# EAGLE design 16 ch sample-and-hold card - single-sided (EAGLE 6.5.0)
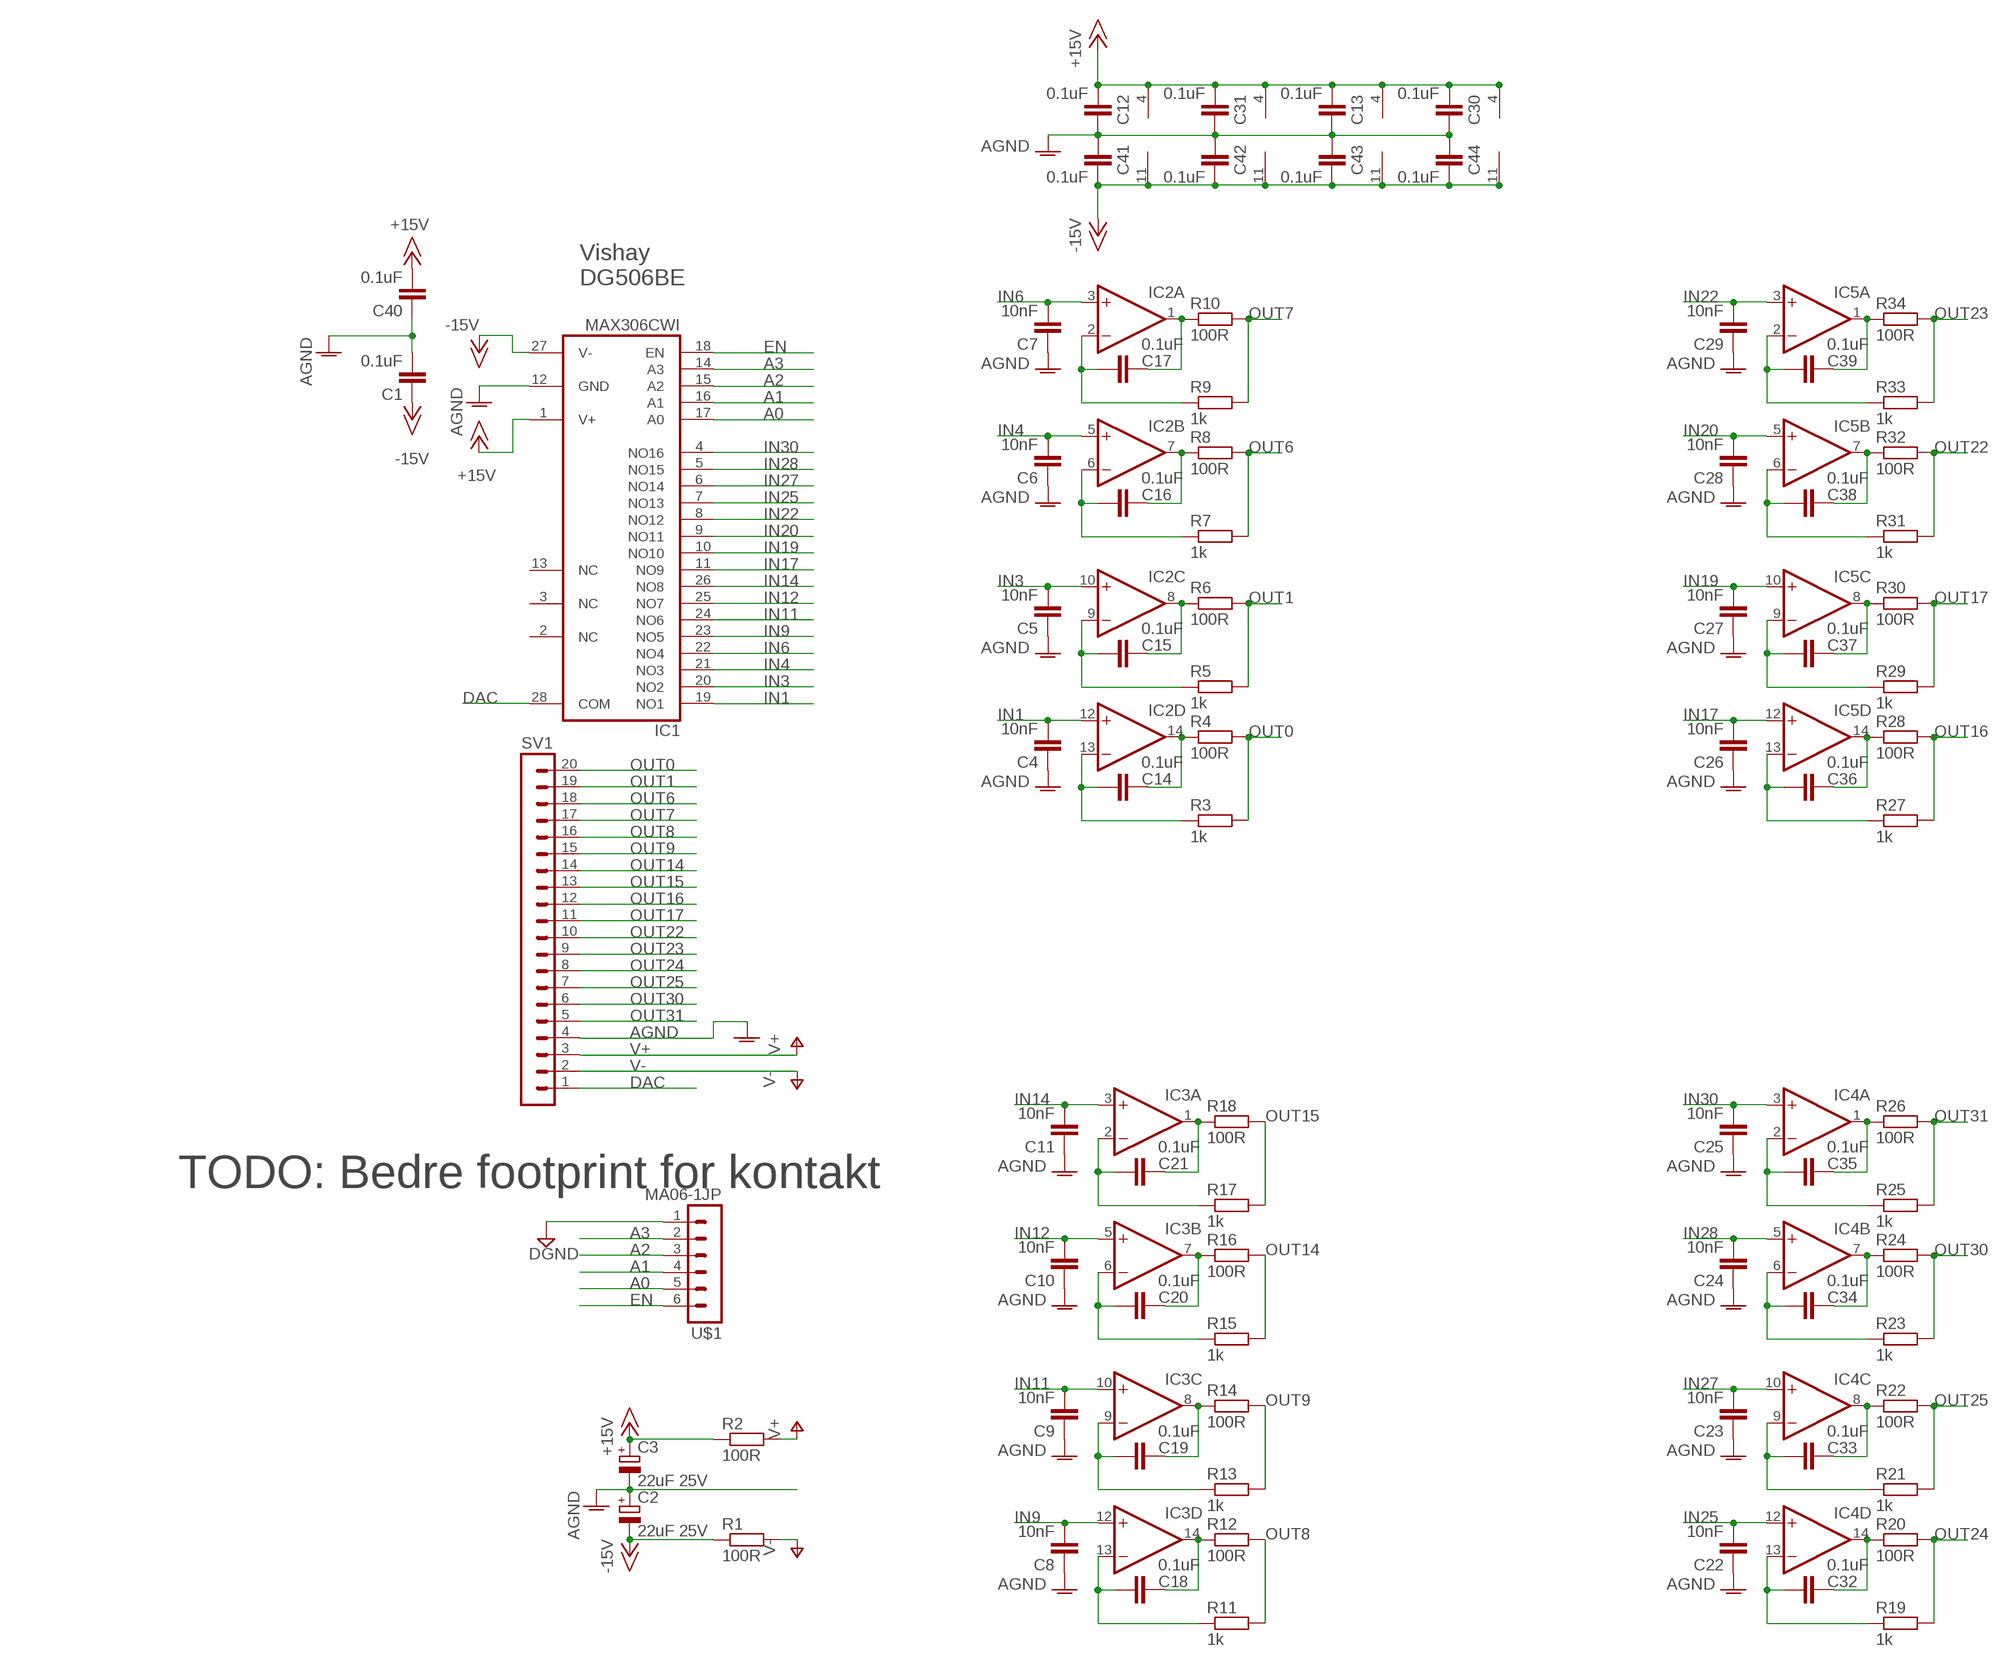
[diagram p0: schematic, sheet 1]

## Parts
C1  0.1uF  C-EUC0603  [C0603]
C2  22uF 25V  CPOL-EUE2.5-5  [E2,5-5]
C3  22uF 25V  CPOL-EUE2.5-5  [E2,5-5]
C4  10nF  C-EUC1206  [C1206]
C5  10nF  C-EUC1206  [C1206]
C6  10nF  C-EUC1206  [C1206]
C7  10nF  C-EUC1206  [C1206]
C8  10nF  C-EUC1206  [C1206]
C9  10nF  C-EUC1206  [C1206]
C10  10nF  C-EUC1206  [C1206]
C11  10nF  C-EUC1206  [C1206]
C12  0.1uF  C-EUC0603  [C0603]
C13  0.1uF  C-EUC0603  [C0603]
C14  0.1uF  C-EUC0603  [C0603]
C15  0.1uF  C-EUC0603  [C0603]
C16  0.1uF  C-EUC0603  [C0603]
C17  0.1uF  C-EUC0603  [C0603]
C18  0.1uF  C-EUC0603  [C0603]
C19  0.1uF  C-EUC0603  [C0603]
C20  0.1uF  C-EUC0603  [C0603]
C21  0.1uF  C-EUC0603  [C0603]
C22  10nF  C-EUC1206  [C1206]
C23  10nF  C-EUC1206  [C1206]
C24  10nF  C-EUC1206  [C1206]
C25  10nF  C-EUC1206  [C1206]
C26  10nF  C-EUC1206  [C1206]
C27  10nF  C-EUC1206  [C1206]
C28  10nF  C-EUC1206  [C1206]
C29  10nF  C-EUC1206  [C1206]
C30  0.1uF  C-EUC0603  [C0603]
C31  0.1uF  C-EUC0603  [C0603]
C32  0.1uF  C-EUC0603  [C0603]
C33  0.1uF  C-EUC0603  [C0603]
C34  0.1uF  C-EUC0603  [C0603]
C35  0.1uF  C-EUC0603  [C0603]
C36  0.1uF  C-EUC0603  [C0603]
C37  0.1uF  C-EUC0603  [C0603]
C38  0.1uF  C-EUC0603  [C0603]
C39  0.1uF  C-EUC0603  [C0603]
C40  0.1uF  C-EUC0603  [C0603]
C41  0.1uF  C-EUC0603  [C0603]
C42  0.1uF  C-EUC0603  [C0603]
C43  0.1uF  C-EUC0603  [C0603]
C44  0.1uF  C-EUC0603  [C0603]
IC1  MAX306CWI  [SO28L]
IC2  TL074D  [SO14]
IC3  TL074D  [SO14]
IC4  TL074D  [SO14]
IC5  TL074D  [SO14]
R1  100R  R-EU_0207/7  [0207/7]
R2  100R  R-EU_0207/7  [0207/7]
R3  1k  R-EU_R0603  [R0603]
R4  100R  R-EU_R0603  [R0603]
R5  1k  R-EU_R0603  [R0603]
R6  100R  R-EU_R0603  [R0603]
R7  1k  R-EU_R0603  [R0603]
R8  100R  R-EU_R0603  [R0603]
R9  1k  R-EU_R0603  [R0603]
R10  100R  R-EU_R0603  [R0603]
R11  1k  R-EU_R0603  [R0603]
R12  100R  R-EU_R0603  [R0603]
R13  1k  R-EU_R0603  [R0603]
R14  100R  R-EU_R0603  [R0603]
R15  1k  R-EU_R0603  [R0603]
R16  100R  R-EU_R0603  [R0603]
R17  1k  R-EU_R0603  [R0603]
R18  100R  R-EU_R0603  [R0603]
R19  1k  R-EU_R0603  [R0603]
R20  100R  R-EU_R0603  [R0603]
R21  1k  R-EU_R0603  [R0603]
R22  100R  R-EU_R0603  [R0603]
R23  1k  R-EU_R0603  [R0603]
R24  100R  R-EU_R0603  [R0603]
R25  1k  R-EU_R0603  [R0603]
R26  100R  R-EU_R0603  [R0603]
R27  1k  R-EU_R0603  [R0603]
R28  100R  R-EU_R0603  [R0603]
R29  1k  R-EU_R0603  [R0603]
R30  100R  R-EU_R0603  [R0603]
R31  1k  R-EU_R0603  [R0603]
R32  100R  R-EU_R0603  [R0603]
R33  1k  R-EU_R0603  [R0603]
R34  100R  R-EU_R0603  [R0603]
SV1  MA20-1JP  [SIP-PIN20-1J]
U$1  MA06-1JP  [SIP-PIN06-1J]

## Nets
+15V: C3.+ C12.1 C13.1 C30.1 C31.1 C40.2 IC1.1(V+) IC2.4(P:V+) IC3.4(P:V+) IC4.4(P:V+) IC5.4(P:V+) R2.1
-15V: C1.1 C2.- C41.2 C42.2 C43.2 C44.2 IC1.27(V-) IC2.11(P:V-) IC3.11(P:V-) IC4.11(P:V-) IC5.11(P:V-) R1.1
A0: IC1.17(A0) U$1.5
A1: IC1.16(A1) U$1.4
A2: IC1.15(A2) U$1.3
A3: IC1.14(A3) U$1.2
AGND: C1.2 C2.+ C3.- C4.1 C5.1 C6.1 C7.1 C8.1 C9.1 C10.1 C11.1 C12.2 C13.2 C22.1 C23.1 C24.1 C25.1 C26.1 C27.1 C28.1 C29.1 C30.2 C31.2 C40.1 C41.1 C42.1 C43.1 C44.1 IC1.12(GND) SV1.4
DAC: IC1.28(COM) SV1.1
DGND: U$1.1
EN: IC1.18(EN) U$1.6
IN1: C4.2 IC1.19(NO1) IC2.12(D:+IN)
IN3: C5.2 IC1.20(NO2) IC2.10(C:+IN)
IN4: C6.2 IC1.21(NO3) IC2.5(B:+IN)
IN6: C7.2 IC1.22(NO4) IC2.3(A:+IN)
IN9: C8.2 IC1.23(NO5) IC3.12(D:+IN)
IN11: C9.2 IC1.24(NO6) IC3.10(C:+IN)
IN12: C10.2 IC1.25(NO7) IC3.5(B:+IN)
IN14: C11.2 IC1.26(NO8) IC3.3(A:+IN)
IN17: C26.2 IC1.11(NO9) IC5.12(D:+IN)
IN19: C27.2 IC1.10(NO10) IC5.10(C:+IN)
IN20: C28.2 IC1.9(NO11) IC5.5(B:+IN)
IN22: C29.2 IC1.8(NO12) IC5.3(A:+IN)
IN25: C22.2 IC1.7(NO13) IC4.12(D:+IN)
IN27: C23.2 IC1.6(NO14) IC4.10(C:+IN)
IN28: C24.2 IC1.5(NO15) IC4.5(B:+IN)
IN30: C25.2 IC1.4(NO16) IC4.3(A:+IN)
N$1: C17.2 IC2.2(A:-IN) R9.1
N$2: C17.1 IC2.1(A:OUT) R10.1
N$3: C16.1 IC2.7(B:OUT) R8.1
N$4: C15.1 IC2.8(C:OUT) R6.1
N$5: C16.2 IC2.6(B:-IN) R7.1
N$6: C14.1 IC2.14(D:OUT) R4.1
N$7: C15.2 IC2.9(C:-IN) R5.1
N$8: C14.2 IC2.13(D:-IN) R3.1
N$9: C21.1 IC3.1(A:OUT) R18.1
N$10: C21.2 IC3.2(A:-IN) R17.1
N$19: C20.1 IC3.7(B:OUT) R16.1
N$20: C20.2 IC3.6(B:-IN) R15.1
N$21: C19.1 IC3.8(C:OUT) R14.1
N$22: C18.1 IC3.14(D:OUT) R12.1
N$23: C19.2 IC3.9(C:-IN) R13.1
N$24: C18.2 IC3.13(D:-IN) R11.1
N$33: C39.1 IC5.1(A:OUT) R34.1
N$34: C39.2 IC5.2(A:-IN) R33.1
N$35: C38.1 IC5.7(B:OUT) R32.1
N$36: C38.2 IC5.6(B:-IN) R31.1
N$37: C37.1 IC5.8(C:OUT) R30.1
N$38: C36.1 IC5.14(D:OUT) R28.1
N$39: C37.2 IC5.9(C:-IN) R29.1
N$40: C36.2 IC5.13(D:-IN) R27.1
N$49: C35.1 IC4.1(A:OUT) R26.1
N$50: C35.2 IC4.2(A:-IN) R25.1
N$51: C34.1 IC4.7(B:OUT) R24.1
N$52: C34.2 IC4.6(B:-IN) R23.1
N$53: C33.1 IC4.8(C:OUT) R22.1
N$54: C32.1 IC4.14(D:OUT) R20.1
N$55: C33.2 IC4.9(C:-IN) R21.1
N$56: C32.2 IC4.13(D:-IN) R19.1
OUT0: R3.2 R4.2 SV1.20
OUT1: R5.2 R6.2 SV1.19
OUT6: R7.2 R8.2 SV1.18
OUT7: R9.2 R10.2 SV1.17
OUT8: R11.2 R12.2 SV1.16
OUT9: R13.2 R14.2 SV1.15
OUT14: R15.2 R16.2 SV1.14
OUT15: R17.2 R18.2 SV1.13
OUT16: R27.2 R28.2 SV1.12
OUT17: R29.2 R30.2 SV1.11
OUT22: R31.2 R32.2 SV1.10
OUT23: R33.2 R34.2 SV1.9
OUT24: R19.2 R20.2 SV1.8
OUT25: R21.2 R22.2 SV1.7
OUT30: R23.2 R24.2 SV1.6
OUT31: R25.2 R26.2 SV1.5
V+: R2.2 SV1.3
V-: R1.2 SV1.2
Unconnected: IC1.2(NC) IC1.3(NC) IC1.13(NC)

## Notes on the sheet
- Vishay
  DG506BE
- TODO: Bedre footprint for kontakt

## Library data of the parts
C1 C4-C44 = resistor:C-EU: CAPACITOR, European symbol
C2 C3 = resistor:CPOL-EU: POLARIZED CAPACITOR, European symbol
IC1 = maxim:MAX306CWI: MULTIPLEXER; MF: MAXIM; MPN: MAX306CWI; OC_FARNELL: unknown; OC_NEWARK: 90C2555
IC2-IC5 = linear:TL074: OP AMP
R1-R34 = resistor:R-EU_: RESISTOR, European symbol
SV1 = joakim:MA20-1J: PIN HEADER
U$1 = joakim:MA06-1J

## Board
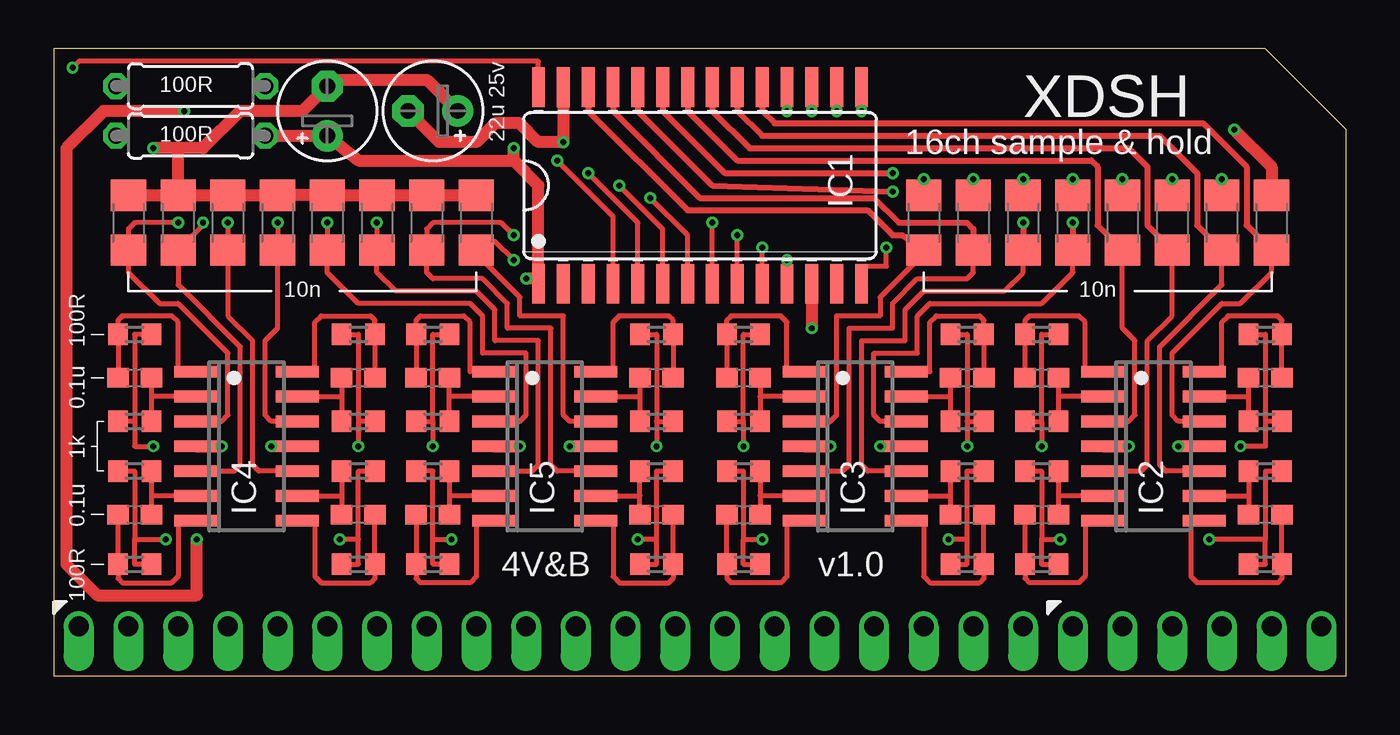
[diagram p1: board, top side]
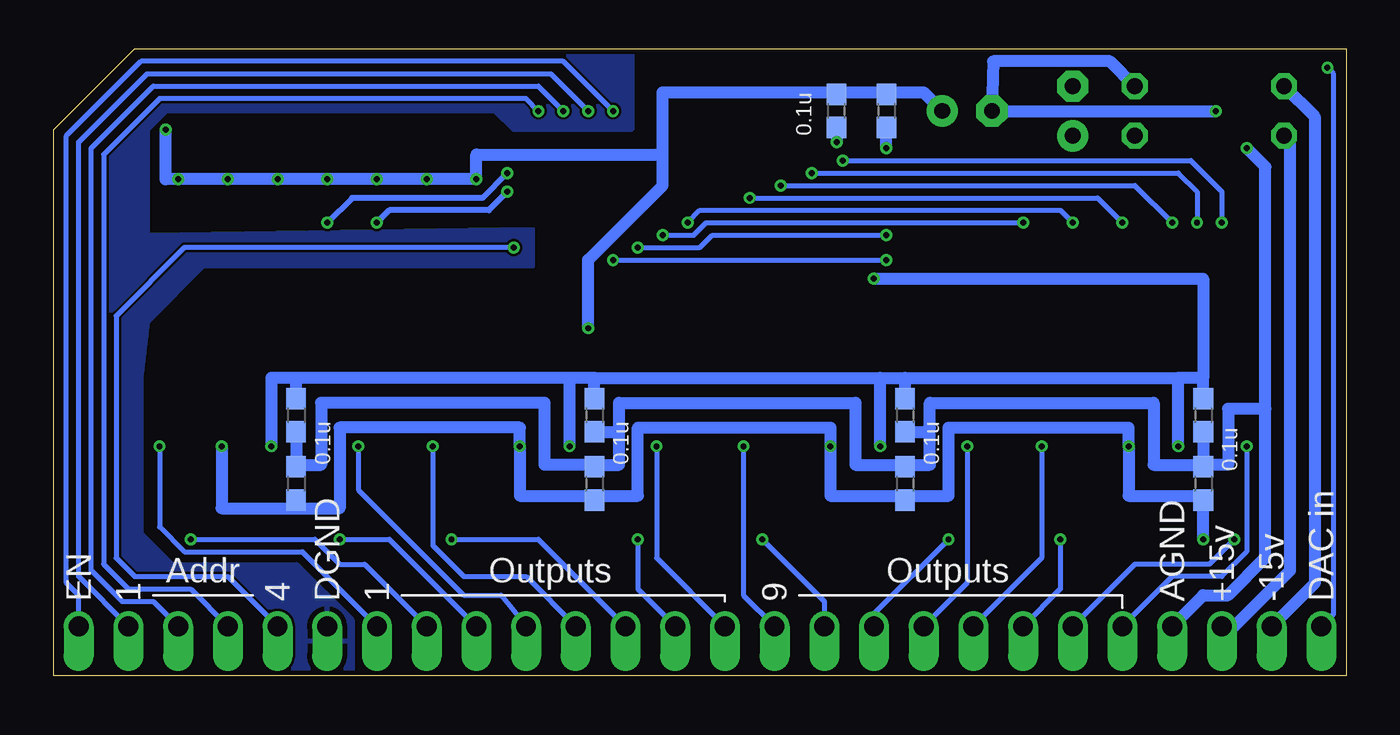
[diagram p2: board, bottom side, seen from below]

Size 66.04 x 32.07 mm. Coordinates in mm from the lower left corner, seen from the top.
Outline: 0,0 66.04,0 66.04,27.94 61.91,32.07 0,32.07 0,0
Copper layers (1*16): Top 0.035mm / dielectric 1.5mm / Bottom 0.035mm
Design rules "dirt_cheap_dirty_boards.v1": minimum track width 5mil, minimum drill 12mil, track to track 5mil, track to pad 5mil, pad to pad 5mil, via to via 5mil, smd to smd 0mil, copper to edge 10mil, drill to drill 10mil, minimum pad ring 10mil, minimum via ring 6mil, stop-mask expansion 2mil, vias tented up to drill 25mil, thermal gap 10mil

### Footprints (pad centres in the part's own frame; a part is rotated, then mirrored left to right if it is on the bottom)
C0603 = smd 1.1 x 1: 1 -0.85,0; 2 0.85,0
E2,5-5 = drill 0.813 pad 1.6: + -1.27,0 | drill 0.813 pad 1.6 octagon: - 1.27,0
C1206 = smd 1.6 x 1.8: 1 -1.4,0; 2 1.4,0
SO28L = smd 0.66 x 2.032: 1 -8.255,-5.029; 2 -6.985,-5.029; 3 -5.715,-5.029; 4 -4.445,-5.029; 5 -3.175,-5.029; 6 -1.905,-5.029; 7 -0.635,-5.029; 8 0.635,-5.029; 9 1.905,-5.029; 10 3.175,-5.029; 11 4.445,-5.029; 12 5.715,-5.029; 13 6.985,-5.029; 14 8.255,-5.029; 15 8.255,5.029; 16 6.985,5.029; 17 5.715,5.029; 18 4.445,5.029; 19 3.175,5.029; 20 1.905,5.029; 21 0.635,5.029; 22 -0.635,5.029; 23 -1.905,5.029; 24 -3.175,5.029; 25 -4.445,5.029; 26 -5.715,5.029; 27 -6.985,5.029; 28 -8.255,5.029
SO14 = smd 0.6 x 2.2: 1 -3.81,-2.6; 2 -2.54,-2.6; 3 -1.27,-2.6; 4 0,-2.6; 5 1.27,-2.6; 6 2.54,-2.6; 7 3.81,-2.6; 8 3.81,2.6; 9 2.54,2.6; 10 1.27,2.6; 11 0,2.6; 12 -1.27,2.6; 13 -2.54,2.6; 14 -3.81,2.6
0207/7 = drill 0.813 octagon: 1 -3.81,0; 2 3.81,0
R0603 = smd 1 x 1.1: 1 -0.85,0; 2 0.85,0
SIP-PIN20-1J = drill 1.016 offset: 1 -24.13,0; 2 -21.59,0; 3 -19.05,0; 4 -16.51,0; 5 -13.97,0; 6 -11.43,0; 7 -8.89,0; 8 -6.35,0; 9 -3.81,0; 10 -1.27,0; 11 1.27,0; 12 3.81,0; 13 6.35,0; 14 8.89,0; 15 11.43,0; 16 13.97,0; 17 16.51,0; 18 19.05,0; 19 21.59,0; 20 24.13,0
SIP-PIN06-1J = drill 1.016 offset: 1 -6.35,0; 2 -3.81,0; 3 -1.27,0; 4 1.27,0; 5 3.81,0; 6 6.35,0

### Placement (x,y rotation side)
C1  26.04,28.89 90 bottom
C2  19.37,28.89 180 top
C3  13.97,28.89 90 top
C4  62.23,23.18 270 top
C5  59.69,23.18 270 top
C6  57.15,23.18 270 top
C7  54.61,23.18 270 top
C8  52.07,23.18 270 top
C9  49.53,23.18 270 top
C10  46.99,23.18 270 top
C11  44.45,23.18 270 top
C12  53.66,13.34 270 bottom
C13  38.42,13.34 270 bottom
C14  61.91,15.24 180 top
C15  61.91,8.26 180 top
C16  50.48,8.26 0 top
C17  50.48,15.24 0 top
C18  46.67,15.24 180 top
C19  46.67,8.26 180 top
C20  35.24,8.26 0 top
C21  35.24,15.24 0 top
C22  11.43,23.18 270 top
C23  8.89,23.18 270 top
C24  6.35,23.18 270 top
C25  3.81,23.18 270 top
C26  21.59,23.18 270 top
C27  19.05,23.18 270 top
C28  16.51,23.18 270 top
C29  13.97,23.18 270 top
C30  7.3,13.34 270 bottom
C31  22.54,13.34 270 bottom
C32  15.56,15.24 180 top
C33  15.56,8.26 180 top
C34  4.13,8.26 0 top
C35  4.13,15.24 0 top
C36  30.8,15.24 180 top
C37  30.8,8.26 180 top
C38  19.37,8.26 0 top
C39  19.37,15.24 0 top
C40  23.5,28.89 270 bottom
C41  7.3,9.84 270 bottom
C42  22.54,9.84 270 bottom
C43  38.42,9.84 270 bottom
C44  53.66,9.84 270 bottom
IC1  33.02,25.08 0 top
IC2  56.2,11.75 270 top
IC3  40.96,11.75 270 top
IC4  9.84,11.75 270 top
IC5  25.08,11.75 270 top
R1  6.99,30.16 180 top
R2  6.99,27.62 180 top
R3  61.91,13.02 0 top
R4  61.91,17.46 180 top
R5  61.91,10.48 0 top
R6  61.91,5.71 180 top
R7  50.48,10.48 180 top
R8  50.48,5.71 0 top
R9  50.48,13.02 180 top
R10  50.48,17.46 0 top
R11  46.67,13.02 0 top
R12  46.67,17.46 180 top
R13  46.67,10.48 0 top
R14  46.67,5.71 180 top
R15  35.24,10.48 180 top
R16  35.24,5.71 0 top
R17  35.24,13.02 180 top
R18  35.24,17.46 0 top
R19  15.56,13.02 0 top
R20  15.56,17.46 180 top
R21  15.56,10.48 0 top
R22  15.56,5.71 180 top
R23  4.13,10.48 180 top
R24  4.13,5.71 0 top
R25  4.13,13.02 180 top
R26  4.13,17.46 0 top
R27  30.8,13.02 0 top
R28  30.8,17.46 180 top
R29  30.8,10.48 0 top
R30  30.8,5.71 180 top
R31  19.37,10.48 180 top
R32  19.37,5.71 0 top
R33  19.37,13.02 180 top
R34  19.37,17.46 0 top
SV1  25.4,2.54 0 top
U$1  58.42,2.54 0 top

### Tracks (layer width: path | path; a pad name or v marks a point on that pad's centre or on a via)
+15V  (via drill 0.3)
  Top 0.61: IC2.4 v54.93,11.75 | IC5.4 v23.81,11.75 | IC4.4 v8.57,11.75 | IC3.4 v39.69,11.75 | 23.5,26.35 15.56,26.35 C3.+ R2.1 | 23.5,26.35 24.77,25.08 IC1.1 24.77,20.32 v24.13,20.32 | 23.5,26.35 v23.5,26.99
  Bottom 0.61: v23.81,11.75 23.81,15.24 | v8.57,11.75 8.57,15.24 | 39.69,15.24 53.66,15.24 | 53.66,15.24 54.93,15.24 v54.93,11.75 | 38.42,15.24 23.81,15.24 | C12.1 53.66,15.24 | C13.1 38.42,15.24 | v39.69,11.75 39.69,15.24 | 38.42,15.24 39.69,15.24 | 23.81,15.24 22.54,15.24 | 22.54,15.24 8.57,15.24 | C30.1 7.3,15.24 | 7.3,15.24 8.57,15.24 | v24.13,20.32 7.3,20.32 7.3,15.24 | v23.5,26.99 C40.2 | C31.1 22.54,15.24
-15V  (via drill 0.3)
  Top 0.61: IC2.11 v57.47,11.75 | IC3.11 v42.23,11.75 | IC5.11 v26.35,11.75 | IC4.11 v11.11,11.75 | v7.3,6.99 7.3,4.13 2.22,4.13 0.64,5.71 0.64,26.99 2.54,28.89 v6.67,28.89 | C2.- 19.68,27.3 21.59,27.3 22.54,28.26 23.81,28.26 24.77,27.3 v26.04,27.3 IC1.27
  Bottom 0.254: C43.2 38.52,8.99 38.73,9.21 | C42.2 22.54,9.21
  Bottom 0.61: 53.76,8.57 51.44,8.57 51.44,12.7 42.23,12.7 v42.23,11.75 42.23,9.21 38.73,9.21 36.2,9.21 36.2,12.7 26.35,12.7 v26.35,11.75 26.35,9.21 22.54,9.21 20.32,9.21 20.32,12.7 11.11,12.7 v11.11,11.75 11.11,9.21 7.52,9.21 C41.2 v7.3,6.99 | v57.47,11.75 57.47,8.57 53.76,8.57 | 53.76,8.57 C44.2 | R1.1 12.06,31.43 18.03,31.43 C2.- v6.67,28.89 | C1.1 v26.04,27.3
A0  (via drill 0.3)
  Top 0.254: v38.73,28.89 IC1.17
  Bottom 0.254: v38.73,28.89 40.64,30.8 61.28,30.8 64.77,27.3 64.77,5.08 U$1.5
A1  (via drill 0.3)
  Top 0.254: IC1.16 v40.01,28.89 40.06,30.16 IC1.16
  Bottom 0.254: v40.01,28.89 41.27,30.16 60.96,30.16 64.14,26.99 64.14,5.4 62.55,3.81 60.96,3.81 U$1.4
A2  (via drill 0.3)
  Top 0.254: IC1.15 v41.27,28.89
  Bottom 0.254: v41.27,28.89 41.91,29.53 60.64,29.53 63.5,26.67 63.5,5.71 62.23,4.45 59.05,4.45 U$1.3
A3  (via drill 0.3)
  Top 0.254: IC1.14 41.33,20.05 41.27,20.95 42.55,20.95 v42.55,21.91
  Bottom 0.254: v42.55,21.91 59.37,21.91 62.87,18.41 62.87,6.03 61.91,5.08 57.15,5.08 U$1.2
AGND  (via drill 0.3)
  Top 0.61: C25.1 C24.1 | C24.1 C23.1 C22.1 C29.1 C28.1 C27.1 C26.1 | C11.1 v44.45,25.4 | v60.33,27.94 62.23,26.04 C4.1 62.23,24.45 | C10.1 v46.99,25.4 | C9.1 v49.53,25.4 | C8.1 v52.07,25.4 | C7.1 v54.61,25.4 | C6.1 v57.15,25.4 | C5.1 v59.69,25.4 | C2.+ 19.05,30.48 14.29,30.48 C3.- 12.7,28.89 9.53,28.89 7.62,26.99 6.35,26.99 | IC1.12 v38.73,17.78 | 6.35,26.99 v5.08,26.99 | C24.1 6.35,26.99
  Bottom 0.61: C44.1 53.66,10.79 | 53.66,10.79 52.39,10.79 52.39,13.97 40.96,13.97 40.96,10.79 38.42,10.79 | v60.33,27.94 60.33,25.4 v59.69,25.4 v57.15,25.4 v54.61,25.4 v52.07,25.4 v49.53,25.4 v46.99,25.4 v44.45,25.4 44.45,26.67 34.92,26.67 | 25.72,29.84 34.92,29.84 34.92,26.67 | 25.72,29.84 23.5,29.84 | 23.5,29.84 21.59,29.84 C2.+ | SV1.4 7.3,4.13 6.03,4.13 4.13,6.03 4.13,13.65 | 4.13,13.65 4.13,26.04 v5.08,26.99 | C43.1 38.42,10.79 | 38.42,10.79 37.15,10.79 37.15,12.38 | 37.15,12.38 37.15,13.97 25.08,13.97 25.08,10.79 22.54,10.79 | C13.2 37.25,12.48 37.15,12.38 | C12.2 53.66,10.79 | 22.54,10.79 21.27,10.79 21.27,12.7 | 21.27,12.7 21.27,13.97 9.84,13.97 9.84,10.79 7.41,10.79 C41.1 | C31.2 21.49,12.48 21.27,12.7 | C42.1 22.54,10.79 | C30.2 C41.1 | 4.13,13.65 6.03,13.65 6.03,10.79 7.2,10.79 C41.1 | v38.73,17.78 38.73,21.27 34.92,25.08 34.92,26.67 | C1.2 25.82,29.74 25.72,29.84 | C40.1 23.5,29.84
DAC  (via drill 0.3)
  Top 0.254: IC1.28 24.77,31.43 1.27,31.43 v0.95,31.11
  Bottom 0.254: SV1.1 0.64,3.17 0.64,30.8 v0.95,31.11
DGND
  pour Bottom: 36.51,32.7 36.51,27.94 42.55,27.94 43.5,28.89 60.33,28.89 61.28,27.94 61.28,22.54 41.59,22.86 41.59,20.95 58.42,20.95 61.28,18.1 61.59,15.24 61.59,7.3 60.01,5.71 53.66,5.71 50.8,2.86 50.8,-0.64 66.36,-0.64 66.67,-0.32 66.67,32.7
EN  (via drill 0.3)
  Top 0.254: IC1.18 v37.47,28.89
  Bottom 0.254: U$1.6 64.77,4.13 65.41,4.76 65.41,27.62 61.59,31.43 40.01,31.43 v37.47,28.89
IN1
  Top 0.254: IC2.12 57.47,13.02 57.15,13.34 57.15,16.51 59.69,19.05 60.64,19.05 62.23,20.64 C4.2
  Top 0.305: IC1.19 36.2,28.89 36.83,28.26 58.74,28.26 60.96,26.04 60.96,23.05 C4.2
IN3
  Top 0.254: IC2.10 56.83,10.48 56.52,10.79 56.52,16.83 59.69,20 C5.2
  Top 0.305: IC1.20 34.92,28.89 36.2,27.62 56.52,27.62 58.42,25.72 58.42,23.05 C5.2
IN4
  Top 0.254: IC2.5 55.56,10.48 55.88,10.79 55.88,17.14 57.15,18.41 57.15,21.59 57.34,21.78 C6.2
  Top 0.305: IC1.21 33.66,28.89 35.56,26.99 54.93,26.99 55.88,26.04 55.88,23.05 C6.2
IN6
  Top 0.254: IC2.3 54.93,13.02 55.24,13.34 55.24,17.14 54.61,17.78 C7.2
  Top 0.305: IC1.22 32.38,28.89 34.92,26.35 53.02,26.35 53.34,26.04 53.34,23.05 C7.2
IN9  (via drill 0.3)
  Top 0.254: IC3.12 42.23,13.02 41.91,13.34 41.91,16.51 44.13,16.51 44.13,18.41 44.77,19.05 50.48,19.05 52.07,20.64 C8.2
  Top 0.305: IC1.23 31.11,28.89 34.29,25.72 v42.86,25.72 | v52.07,23.18 C8.2
  Bottom 0.305: v42.86,25.72 44.13,24.45 50.8,24.45 v52.07,23.18
IN11  (via drill 0.3)
  Top 0.254: IC3.10 41.59,10.48 41.27,10.79 41.27,17.14 43.5,17.14 43.5,18.73 44.45,19.68 48.58,19.68 49.53,20.64 C9.2
  Top 0.305: IC1.24 29.84,28.89 33.66,25.08 v42.86,24.77 | v49.53,23.18 C9.2
  Bottom 0.305: v42.86,24.77 43.81,23.81 48.9,23.81 v49.53,23.18
IN12
  Top 0.254: IC3.5 40.32,10.48 40.64,10.79 40.64,17.78 42.86,17.78 42.86,19.05 44.13,20.32 46.67,20.32 46.99,20.64 C10.2
  Top 0.305: IC1.25 28.57,28.89 33.02,24.45 41.91,24.45 43.18,23.18 46.67,23.18 46.99,22.86 C10.2
IN14
  Top 0.254: IC3.3 39.69,13.02 40.01,13.34 40.01,18.41 42.23,18.41 42.23,19.37 44.13,21.27 44.45,21.27 C11.2
  Top 0.305: IC1.26 27.3,28.89 32.38,23.81 41.59,23.81 42.86,22.54 43.37,22.54 C11.2
IN17  (via drill 0.3)
  Top 0.254: IC5.12 26.35,13.02 26.04,13.34 26.04,18.41 23.81,18.41 23.81,19.37 21.91,21.27 22.09,21.27 C26.2 21.59,22.23 22.54,22.23 v23.5,21.27 | IC1.11 v37.47,21.27
  Bottom 0.254: v37.47,21.27 v23.5,21.27
IN19  (via drill 0.3)
  Top 0.254: IC5.10 25.72,10.48 25.4,10.79 25.4,17.78 23.18,17.78 23.18,19.05 21.91,20.32 19.37,20.32 19.05,20.64 C27.2 19.05,22.86 19.37,23.18 22.86,23.18 v23.5,22.54 | IC1.10 v36.2,21.91
  Bottom 0.254: v36.2,21.91 33.02,21.91 32.38,22.54 v23.5,22.54
IN20  (via drill 0.3)
  Top 0.254: IC5.5 24.45,10.48 24.77,10.79 24.77,17.14 22.54,17.14 22.54,18.73 21.59,19.68 17.46,19.68 16.51,20.64 C28.2 v16.51,23.18 | IC1.9 v34.92,22.54
  Bottom 0.254: v34.92,22.54 33.34,22.54 32.7,23.18 v16.51,23.18
IN22  (via drill 0.3)
  Top 0.254: IC5.3 23.81,13.02 24.13,13.34 24.13,16.51 21.91,16.51 21.91,18.41 21.27,19.05 15.56,19.05 13.97,20.64 C29.2 v13.97,23.18 | IC1.8 v33.66,23.18
  Bottom 0.254: v33.66,23.18 33.02,23.81 14.61,23.81 v13.97,23.18
IN25  (via drill 0.3)
  Top 0.254: IC4.12 11.11,13.02 10.79,13.34 10.79,17.14 11.43,17.78 C22.2 v11.43,23.18 | IC1.7 32.38,22.54 v30.48,24.45
  Bottom 0.254: v30.48,24.45 12.7,24.45 v11.43,23.18
IN27  (via drill 0.3)
  Top 0.254: IC4.10 10.48,10.48 10.16,10.79 10.16,17.14 8.89,18.41 C23.2 v8.89,23.18 | IC1.6 31.11,22.86 v28.89,25.08
  Bottom 0.254: v28.89,25.08 10.79,25.08 v8.89,23.18
IN28  (via drill 0.3)
  Top 0.254: IC4.5 9.21,10.48 9.53,10.79 9.53,16.83 6.35,20 C24.2 7.62,23.05 v7.62,23.18 | IC1.5 29.84,23.18 v27.3,25.72
  Bottom 0.254: v27.3,25.72 8.57,25.72 7.62,24.77 v7.62,23.18
IN30  (via drill 0.3)
  Top 0.254: IC4.3 8.57,13.02 8.89,13.34 8.89,16.51 6.35,19.05 5.4,19.05 3.81,20.64 C25.2 3.81,22.86 4.13,23.18 v6.35,23.18 | IC1.4 28.57,23.5 v25.72,26.35
  Bottom 0.254: v25.72,26.35 7.94,26.35 6.35,24.77 v6.35,23.18
N$1
  Top 0.254: C17.2 R9.1 51.33,14.29 IC2.2
N$2
  Top 0.254: C17.1 R10.1 49.63,18.2 49.85,18.41 52.39,18.41 52.7,18.1 52.7,15.56 IC2.1
N$3
  Top 0.254: C16.1 R8.1 49.63,4.98 49.85,4.76 52.39,4.76 52.7,5.08 52.7,7.94 IC2.7
N$4
  Top 0.254: C15.1 R6.1 62.76,4.98 62.55,4.76 58.42,4.76 58.1,5.08 58.1,7.94 IC2.8
N$5
  Top 0.254: R7.1 C16.2 51.33,9.21 IC2.6
N$6
  Top 0.254: C14.1 R4.1 62.76,18.2 62.55,18.41 60.01,18.41 59.69,18.1 59.69,15.56 IC2.14
N$7
  Top 0.254: R5.1 C15.2 61.06,9.21 IC2.9
N$8
  Top 0.254: C14.2 R3.1 61.06,14.29 IC2.13
N$9
  Top 0.254: C21.1 R18.1 34.39,18.2 34.61,18.41 37.15,18.41 37.47,18.1 37.47,15.56 IC3.1
N$10
  Top 0.254: C21.2 R17.1 36.09,14.29 IC3.2
N$19
  Top 0.254: C20.1 R16.1 34.39,4.98 34.61,4.76 37.15,4.76 37.47,5.08 37.47,7.94 IC3.7
N$20
  Top 0.254: R15.1 C20.2 36.09,9.21 IC3.6
N$21
  Top 0.254: C19.1 R14.1 47.52,4.98 47.31,4.76 44.77,4.76 44.45,5.08 44.45,7.94 IC3.8
N$22
  Top 0.254: C18.1 R12.1 47.52,18.2 47.31,18.41 45.09,18.41 44.77,18.1 44.77,15.56 IC3.14
N$23
  Top 0.254: R13.1 C19.2 45.82,9.21 IC3.9
N$24
  Top 0.254: C18.2 R11.1 45.82,14.29 IC3.13
N$33
  Top 0.254: C39.1 R34.1 18.52,18.2 18.73,18.41 20.95,18.41 21.27,18.1 21.27,15.56 IC5.1
N$34
  Top 0.254: C39.2 R33.1 20.22,14.29 IC5.2
N$35
  Top 0.254: C38.1 R32.1 18.52,4.98 18.73,4.76 21.27,4.76 21.59,5.08 21.59,7.94 IC5.7
N$36
  Top 0.254: R31.1 C38.2 20.22,9.21 IC5.6
N$37
  Top 0.254: C37.1 R30.1 31.65,4.98 31.43,4.76 28.89,4.76 28.57,5.08 28.57,7.94 IC5.8
N$38
  Top 0.254: C36.1 R28.1 31.65,18.2 31.43,18.41 28.89,18.41 28.57,18.1 28.57,15.56 IC5.14
N$39
  Top 0.254: R29.1 C37.2 29.95,9.21 IC5.9
N$40
  Top 0.254: C36.2 R27.1 29.95,14.29 IC5.13
N$49
  Top 0.254: C35.1 R26.1 3.28,18.2 3.49,18.41 6.03,18.41 6.35,18.1 6.35,15.56 IC4.1
N$50
  Top 0.254: C35.2 R25.1 4.98,14.29 IC4.2
N$51
  Top 0.254: C34.1 R24.1 3.28,4.98 3.49,4.76 6.03,4.76 6.35,5.08 6.35,7.94 IC4.7
N$52
  Top 0.254: R23.1 C34.2 4.98,9.21 IC4.6
N$53
  Top 0.254: C33.1 R22.1 16.41,4.98 16.19,4.76 13.65,4.76 13.34,5.08 13.34,7.94 IC4.8
N$54
  Top 0.254: C32.1 R20.1 16.41,18.2 16.19,18.41 13.65,18.41 13.34,18.1 13.34,15.56 IC4.14
N$55
  Top 0.254: R21.1 C33.2 14.71,9.21 IC4.9
N$56
  Top 0.254: C32.2 R19.1 14.71,14.29 IC4.13
OUT0  (via drill 0.3)
  Top 0.254: R4.2 61.91,17.46 61.91,13.02 | 61.91,13.02 61.91,11.75 v60.64,11.75 | R3.2 61.91,13.02
  Bottom 0.254: v60.64,11.75 60.64,7.62 59.37,6.35 53.34,6.35 SV1.20
OUT1  (via drill 0.3)
  Top 0.254: R5.2 61.91,10.48 61.91,6.99 | 61.91,6.99 v59.05,6.99 | R6.2 61.91,5.71 61.91,6.99
  Bottom 0.254: v59.05,6.99 52.7,6.99 51.44,5.71 50.16,5.71 SV1.19
OUT6  (via drill 0.3)
  Top 0.254: R7.2 50.48,10.48 50.48,6.99 | R8.2 50.48,5.71 50.48,6.99 | 50.48,6.99 v51.44,6.99
  Bottom 0.254: v51.44,6.99 48.9,6.99 SV1.18
OUT7  (via drill 0.3)
  Top 0.254: 50.48,13.02 50.48,17.46 R10.2 | R9.2 50.48,13.02 | 50.48,13.02 v50.48,11.75
  Bottom 0.254: v50.48,11.75 50.48,9.53 45.09,4.13 43.18,4.13 SV1.17
OUT8  (via drill 0.3)
  Top 0.254: R12.2 46.67,17.46 46.67,13.02 | 46.67,13.02 R11.2 | 46.67,13.02 v46.67,11.75
  Bottom 0.254: v46.67,11.75 46.67,6.67 45.09,5.08 41.91,5.08 SV1.16
OUT9  (via drill 0.3)
  Top 0.254: 46.67,6.99 46.67,10.48 R13.2 | R14.2 46.67,5.71 46.67,6.99 | 46.67,6.99 v45.72,6.99
  Bottom 0.254: v45.72,6.99 41.27,6.99 SV1.15
OUT14  (via drill 0.3)
  Top 0.254: R15.2 35.24,10.48 35.24,6.99 | R16.2 35.24,5.71 35.24,6.99 | 35.24,6.99 v36.2,6.99
  Bottom 0.254: v36.2,6.99 36.2,4.45 SV1.14
OUT15  (via drill 0.3)
  Top 0.254: 35.24,13.02 35.24,17.46 R18.2 | R17.2 35.24,13.02 | 35.24,13.02 v35.24,11.75
  Bottom 0.254: v35.24,11.75 35.24,6.03 SV1.13
OUT16  (via drill 0.3)
  Top 0.254: R28.2 30.8,17.46 30.8,13.02 | 30.8,13.02 R27.2 | 30.8,13.02 v30.8,11.75
  Bottom 0.254: v30.8,11.75 30.8,4.13 SV1.12
OUT17  (via drill 0.3)
  Top 0.254: 30.8,6.99 30.8,10.48 R29.2 | R30.2 30.8,5.71 30.8,6.99 | 30.8,6.99 v29.84,6.99
  Bottom 0.254: v29.84,6.99 26.67,3.81 SV1.11
OUT22  (via drill 0.3)
  Top 0.254: 19.37,6.99 19.37,10.48 R31.2 | R32.2 19.37,5.71 19.37,6.99 | 19.37,6.99 v20.32,6.99
  Bottom 0.254: v20.32,6.99 24.13,3.17 SV1.10
OUT23  (via drill 0.3)
  Top 0.254: R33.2 19.37,13.02 | 19.37,13.02 19.37,17.46 R34.2 | 19.37,13.02 v19.37,11.75
  Bottom 0.254: v19.37,11.75 19.37,4.76 SV1.9
OUT24  (via drill 0.3)
  Top 0.254: R20.2 15.56,17.46 15.56,13.02 | R19.2 15.56,13.02 | 15.56,13.02 v15.56,11.75
  Bottom 0.254: v15.56,11.75 15.56,6.03 SV1.8
OUT25  (via drill 0.3)
  Top 0.254: R22.2 15.56,5.71 15.56,6.99 | 15.56,6.99 15.56,10.48 R21.2 | 15.56,6.99 v14.61,6.99
  Bottom 0.254: v14.61,6.99 14.61,4.45 SV1.7
OUT30  (via drill 0.3)
  Top 0.254: R23.2 4.13,10.48 4.13,6.99 | R24.2 4.13,5.71 4.13,6.99 | 4.13,6.99 v5.71,6.99
  Bottom 0.254: v5.71,6.99 6.99,5.71 10.79,5.71 SV1.6
OUT31  (via drill 0.3)
  Top 0.254: R26.2 4.13,17.46 4.13,13.02 | 4.13,13.02 R25.2 | 4.13,13.02 4.13,11.75 v5.08,11.75
  Bottom 0.254: v5.08,11.75 5.08,6.35 6.35,5.08 8.89,5.08 SV1.5
V+
  Bottom 0.61: SV1.3 5.71,2.54 2.86,5.4 2.86,27.3 R2.2
V-
  Bottom 0.61: SV1.2 1.59,4.76 1.59,28.57 R1.2

### Text on the board
tNames: 22u 25v | 100R | XDSH | 100R | 16ch sample & hold | 10n | 10n | 100R | 0.1u | 1k | 0.1u | 4V&B | v1.0 | 100R
bNames: 0.1u | 0.1u | 0.1u | 0.1u | 0.1u | Outputs | Outputs | Addr | DAC in | -15v | +15v | AGND | 9 | 1 | DGND | 4 | 1 | EN